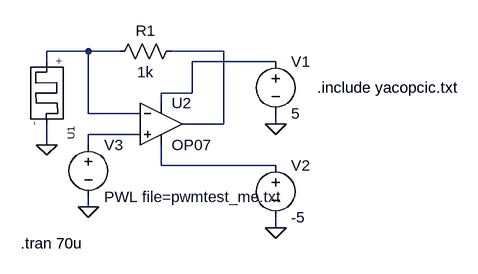
[diagram p0: schematic programmer.asc]
programmer.asc, the LTspice schematic file:
Version 4
SHEET 1 880 680
WIRE 48 0 -16 0
WIRE 96 0 48 0
WIRE 256 0 176 0
WIRE -16 16 -16 0
WIRE 336 16 208 16
WIRE 208 64 208 16
WIRE 208 64 160 64
WIRE 160 80 160 64
WIRE 48 96 48 0
WIRE 128 96 48 96
WIRE 256 112 256 0
WIRE 256 112 192 112
WIRE 336 112 336 96
WIRE 128 128 48 128
WIRE -16 144 -16 112
WIRE 48 144 48 128
WIRE 160 176 160 144
WIRE 336 176 160 176
WIRE 48 240 48 224
WIRE 336 272 336 256
FLAG -16 144 0
FLAG 336 112 0
FLAG 336 272 0
FLAG 48 240 0
SYMBOL memristormodel -16 96 R90
SYMATTR InstName U1
SYMATTR Value MEM_YAKOPCIC
SYMBOL Opamps\\OP07 160 48 R0
SYMATTR InstName U2
SYMBOL res 192 -16 R90
WINDOW 0 0 56 VBottom 2
WINDOW 3 32 56 VTop 2
SYMATTR InstName R1
SYMATTR Value 1k
SYMBOL voltage 336 0 R0
WINDOW 123 0 0 Left 2
WINDOW 39 0 0 Left 2
SYMATTR InstName V1
SYMATTR Value 5
SYMBOL voltage 336 160 R0
WINDOW 123 0 0 Left 2
WINDOW 39 0 0 Left 2
SYMATTR InstName V2
SYMATTR Value -5
SYMBOL voltage 48 128 R0
WINDOW 123 0 0 Left 2
WINDOW 39 0 0 Left 2
SYMATTR InstName V3
SYMATTR Value PWL file=pwmtest_me.txt
TEXT 400 56 Left 2 !.include yacopcic.txt
TEXT -56 296 Left 2 !.tran 70u

The netlist it stands for:
* programmer.asc
XU1 N001 0 M MEM_YAKOPCIC  ; pins + -
XU2 N004 N001 N003 N005 N002 LT1001  ; OP07, pins In+ In- V+ V- OUT
R1 N002 N001 1k
V1 N003 0 5
V2 N005 0 -5
V3 N004 0 PWL file=pwmtest_me.txt
.include yacopcic.txt
.tran 70u
.lib LTC.lib
.backanno
.end